# Altium schematic sheet InterfaceBoard.SchDoc
size A
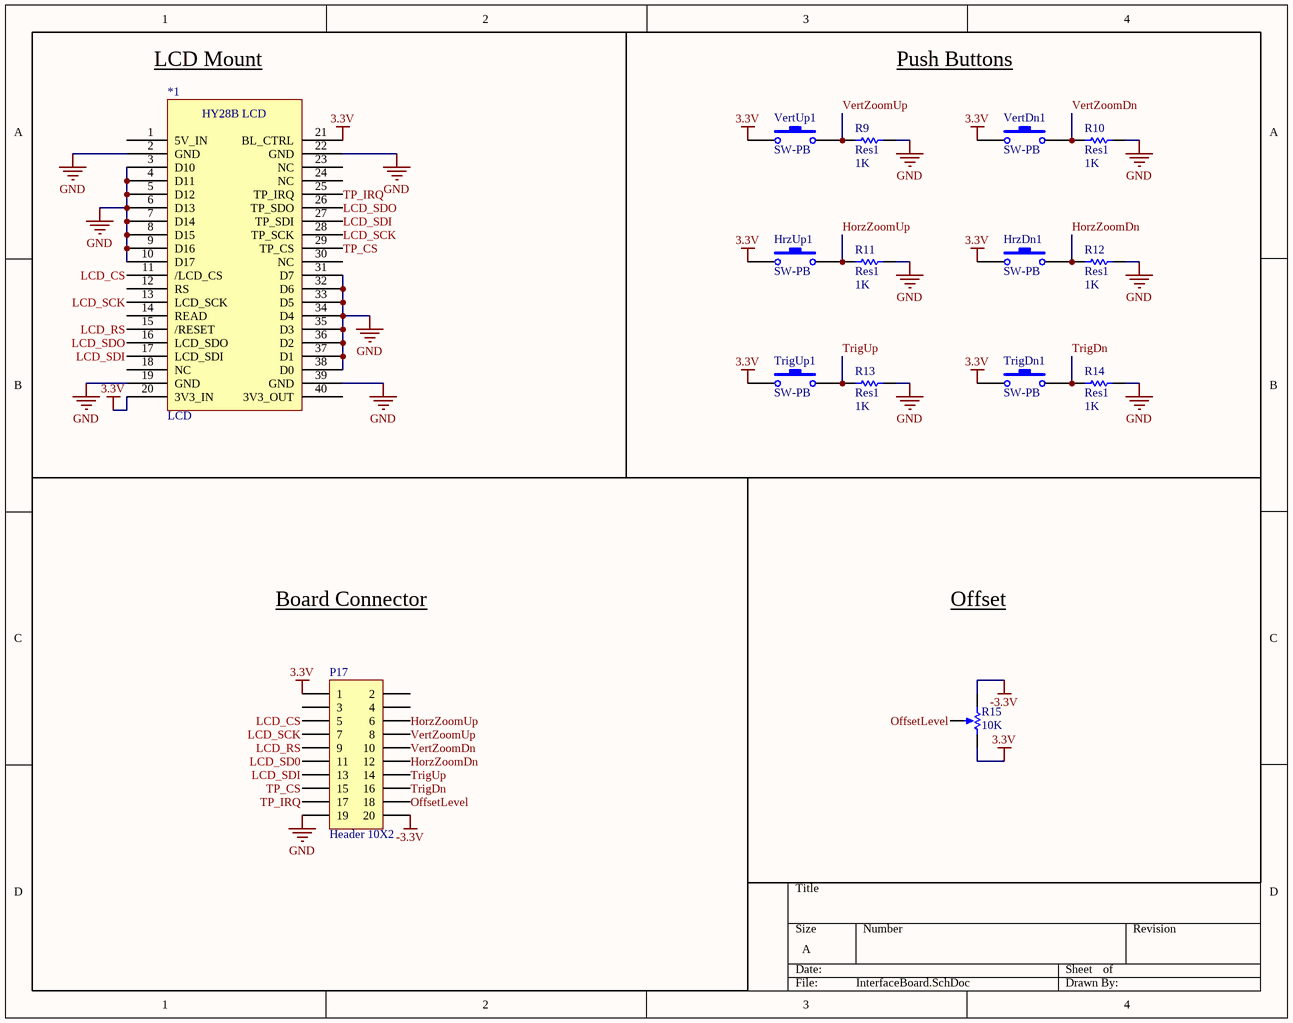
[diagram p0: InterfaceBoard.SchDoc]

## Parts
*1  LCD  [LCD Footprint]
HrzDn1  SW-PB  [SW PB]
HrzUp1  SW-PB  [SW PB]
P17  Header 10X2  [HDR2X10]
R9  Res1  value 1K  [AXIAL-0.3]
R10  Res1  value 1K  [AXIAL-0.3]
R11  Res1  value 1K  [AXIAL-0.3]
R12  Res1  value 1K  [AXIAL-0.3]
R13  Res1  value 1K  [AXIAL-0.3]
R14  Res1  value 1K  [AXIAL-0.3]
R15  value 10K  [BigPot]  (hidden comment: RPot_3)
TrigDn1  SW-PB  [SW PB]
TrigUp1  SW-PB  [SW PB]
VertDn1  SW-PB  [SW PB]
VertUp1  SW-PB  [SW PB]

## Blocks framed on the sheet
LCD Mount: *1
Push Buttons: HrzDn1 HrzUp1 R9-R14 TrigDn1 TrigUp1 VertDn1 VertUp1
Board Connector: P17
Offset: R15

## Nets
3.3V: *1.20(3V3_IN) *1.21(BL_CTRL) HrzDn1.1 HrzUp1.1 P17.1 R15.3(BOT) TrigDn1.1 TrigUp1.1 VertDn1.1 VertUp1.1
-3.3V: P17.20 R15.1(TOP)
GND: *1.2(GND) *1.3(D10) *1.4(D11) *1.5(D12) *1.6(D13) *1.7(D14) *1.8(D15) *1.9(D16) *1.10(D17) *1.19(GND) *1.22(GND) *1.31(D7) *1.32(D6) *1.33(D5) *1.34(D4) *1.35(D3) *1.36(D2) *1.37(D1) *1.38(D0) *1.39(GND) P17.19 R9.2 R10.2 R11.2 R12.2 R13.2 R14.2
HorzZoomDn: HrzDn1.2 P17.12 R12.1
HorzZoomUp: HrzUp1.2 P17.6 R11.1
LCD_CS: *1.11(/LCD_CS) P17.5
LCD_RS: *1.15(/RESET) P17.9
LCD_SCK: *1.13(LCD_SCK) *1.28(TP_SCK) P17.7
LCD_SD0: P17.11
LCD_SDI: *1.17(LCD_SDI) *1.27(TP_SDI) P17.13
LCD_SDO: *1.16(LCD_SDO) *1.26(TP_SDO)
OffsetLevel: P17.18 R15.2(TAP)
TP_CS: *1.29(TP_CS) P17.15
TP_IRQ: *1.25(TP_IRQ) P17.17
TrigDn: P17.16 R14.1 TrigDn1.2
TrigUp: P17.14 R13.1 TrigUp1.2
VertZoomDn: P17.10 R10.1 VertDn1.2
VertZoomUp: P17.8 R9.1 VertUp1.2

Not connected (* = marked no-connect by the designer): *1 1(5V_IN) 12(RS) 14(READ) 18(NC) 23(NC) 24(NC) 30(NC) 40(3V3_OUT); P17 2 3 4

## Notes on the sheet
- (in symbol LCD) HY28B LCD

## Library data of the parts
HrzDn1 HrzUp1 TrigDn1 TrigUp1 VertDn1 VertUp1 = SW-PB: DIGIKEY SW400-ND; Published: 24-Mar-1999; LatestRevisionDate: 17-Jul-2002; LatestRevisionNote: Re-released for DXP Platform.; Publisher: Altium Limited
P17 = Header 10X2: Header, 10-Pin, Dual row; LatestRevisionDate: 17-Jul-2002; LatestRevisionNote: Re-released for DXP Platform.; Publisher: Altium Limited
R9-R14 = Res1: Resistor; Published: 8-Jun-2000; LatestRevisionDate: 17-Jul-2002; LatestRevisionNote: Re-released for DXP Platform.; PackageReference: AXIAL-0.3; Publisher: Altium Limited; PackageDescription: Axial Device, Thru-Hole; 2 Leads; 0.3 in Pin Spacing
R15 = RPot: Potentiometer; Sim Note: Enter the Resistance value and the set point into parameter fields.; Set Position: 0.5; Published: 8-Jun-2000; LatestRevisionDate: 17-Jul-2002; LatestRevisionNote: Re-released for DXP Platform.; Publisher: Altium Limited